# Altium schematic sheet Sheet_handling_module.SchDoc
size A4
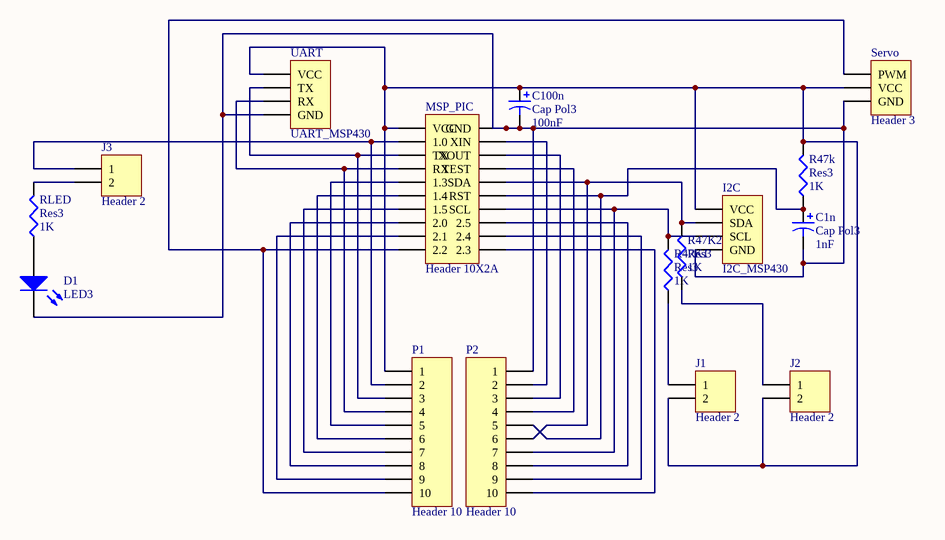
[diagram p0: Sheet_handling_module.SchDoc]

## Parts
C1n  Cap Pol3  value 1nF  [C0805]
C100n  Cap Pol3  value 100nF  [C0805]
D1  LED3  [6-0805_L]
I2C  I2C_MSP430  [HDR1X4]
J1  Header 2  [HDR1X2]
J2  Header 2  [HDR1X2]
J3  Header 2  [HDR1X2]
MSP_PIC  Header 10X2A  [N020]
P1  Header 10  [HDR1X10]
P2  Header 10  [HDR1X10]
R47k  Res3  value 1K  [INDC3216]
R47K1  Res3  value 1K  [INDC3216]
R47K2  Res3  value 1K  [INDC3216]
RLED  Res3  value 1K  [INDC3216]
Servo  Header 3  [HDR1X3]
UART  UART_MSP430  [HDR1X4]

## Nets
NetC1n_1: C1n.1 MSP_PIC.16(RST) P2.5 R47k.1
NetC1n_2: C1n.2 C100n.2 D1.2(K) I2C.1(GND) MSP_PIC.20(GND) P2.1 Servo.3(GND) UART.1(GND)
NetC100n_1: C100n.1 I2C.4(VCC) J1.2 J2.2 MSP_PIC.1(VCC) P1.1 R47k.2 Servo.2(VCC) UART.4(VCC)
NetD1_1: D1.1(A) RLED.1
NetI2C_2: I2C.2(SDA) MSP_PIC.15(SDA) P2.6 R47K2.2
NetI2C_3: I2C.3(SCL) MSP_PIC.14(SCL) P2.7 R47K1.2
NetJ1_1: J1.1 R47K1.1
NetJ2_1: J2.1 R47K2.1
NetJ3_1: J3.1 MSP_PIC.2(1.0) P1.2
NetJ3_2: J3.2 RLED.2
NetMSP_PIC_3: MSP_PIC.3(TX) P1.3 UART.2(TX)
NetMSP_PIC_4: MSP_PIC.4(RX) P1.4 UART.3(RX)
NetMSP_PIC_5: MSP_PIC.5(1.3) P1.5
NetMSP_PIC_6: MSP_PIC.6(1.4) P1.6
NetMSP_PIC_7: MSP_PIC.7(1.5) P1.7
NetMSP_PIC_8: MSP_PIC.8(2.0) P1.8
NetMSP_PIC_9: MSP_PIC.9(2.1) P1.9
NetMSP_PIC_10: MSP_PIC.10(2.2) P1.10 Servo.1(PWM)
NetMSP_PIC_11: MSP_PIC.11(2.3) P2.10
NetMSP_PIC_12: MSP_PIC.12(2.4) P2.9
NetMSP_PIC_13: MSP_PIC.13(2.5) P2.8
NetMSP_PIC_17: MSP_PIC.17(TEST) P2.4
NetMSP_PIC_18: MSP_PIC.18(XOUT) P2.3
NetMSP_PIC_19: MSP_PIC.19(XIN) P2.2

## Library data of the parts
C1n C100n = Cap Pol3: Polarized Capacitor (Surface Mount); Published: 8-Jun-2000; LatestRevisionDate: 29-May-2009; LatestRevisionNote: IPC-7351 Footprint Added.; PackageReference: C0805; Publisher: Altium Limited; PackageDescription: Chip Capacitor
D1 = LED3: Typical BLUE SiC LED; Published: 8-Jun-2000; LatestRevisionDate: 17-Dec-2003; LatestRevisionNote: PCB Footprint replaced.; DatasheetVersion: 16-Apr-2002; PackageVersion: 16-Apr-2002; PackageReference: 3.5X2.8X1.9; Publisher: Altium Limited; PackageDescription: SM LED; 2 C-Bend Leads; Body 3.5 x 2.8 x 1.9 mm, inc leads (LxWxH typ)
I2C UART = Header 4: Header, 4-Pin; LatestRevisionDate: 17-Jul-2002; LatestRevisionNote: Re-released for DXP Platform.; Publisher: Altium Limited
J1-J3 = Header 2: Header, 2-Pin; LatestRevisionDate: 17-Jul-2002; LatestRevisionNote: Re-released for DXP Platform.; Publisher: Altium Limited
MSP_PIC = Header 10X2A: Header, 10-Pin, Dual row; LatestRevisionDate: 17-Jul-2002; LatestRevisionNote: Re-released for DXP Platform.; Publisher: Altium Limited
P1 P2 = Header 10: Header, 10-Pin; LatestRevisionDate: 17-Jul-2002; LatestRevisionNote: Re-released for DXP Platform.; Publisher: Altium Limited
R47k R47K1 R47K2 RLED = Res3: Resistor; Published: 8-Jun-2000; LatestRevisionDate: 29-May-2009; LatestRevisionNote: IPC-7351 Footprint Added.; PackageReference: J1-0603; Publisher: Altium Limited; PackageDescription: Chip Resistor
Servo = Header 3: Header, 3-Pin; LatestRevisionDate: 17-Jul-2002; LatestRevisionNote: Re-released for DXP Platform.; Publisher: Altium Limited